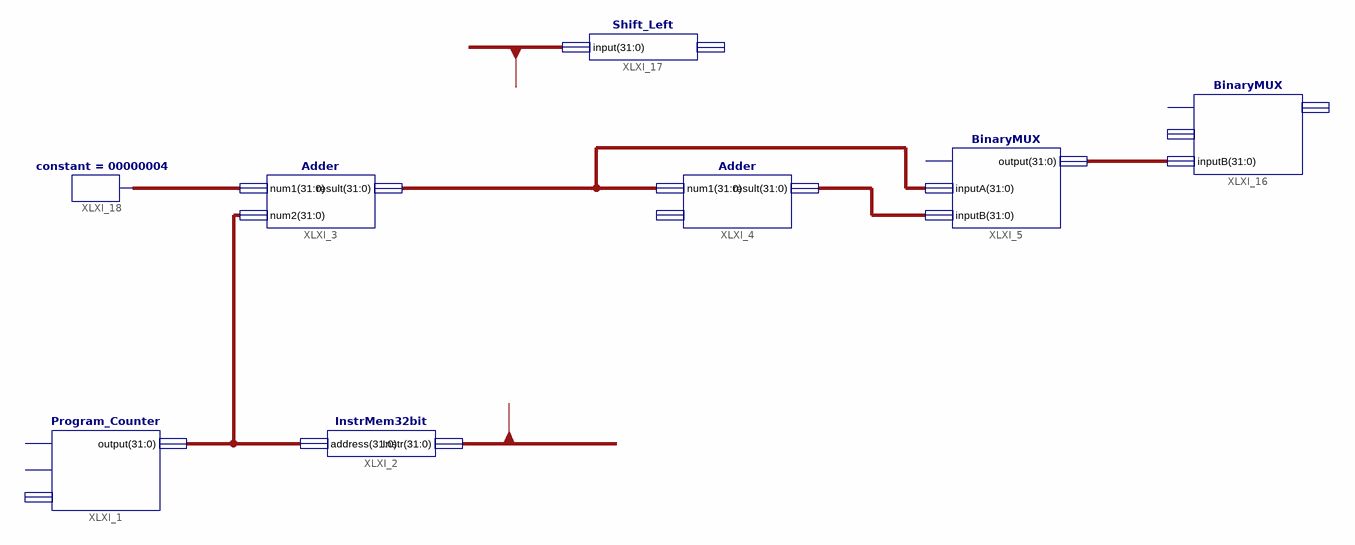
[diagram p0: schematic sheet 1]
// Xilinx ISE schematic InstructionFetch.sch (artix7) as structural Verilog: 8 symbols, 0 ports
module InstructionFetch (
);

  wire [25:0] XLXN_19;
  wire [31:0] XLXN_1, XLXN_3, XLXN_4, XLXN_6, XLXN_17, XLXN_20;

  InstrMem32bit XLXI_2 (.address(XLXN_1), .Instr(XLXN_19));
  Program_Counter XLXI_1 (.\output (XLXN_1));  // open: reset, clk, input
  Adder XLXI_3 (.num1(XLXN_3), .num2(XLXN_1), .result(XLXN_4));
  Adder XLXI_4 (.num1(XLXN_4), .result(XLXN_6));  // open: num2
  BinaryMUX XLXI_5 (.inputA(XLXN_4), .inputB(XLXN_6), .\output (XLXN_17));  // open: sel
  BinaryMUX XLXI_16 (.inputB(XLXN_17));  // open: sel, inputA, output
  Shift_Left XLXI_17 (.\input (XLXN_20));  // open: output
  constant #(.CValue("00000004")) XLXI_18 (.O(XLXN_3));
endmodule
